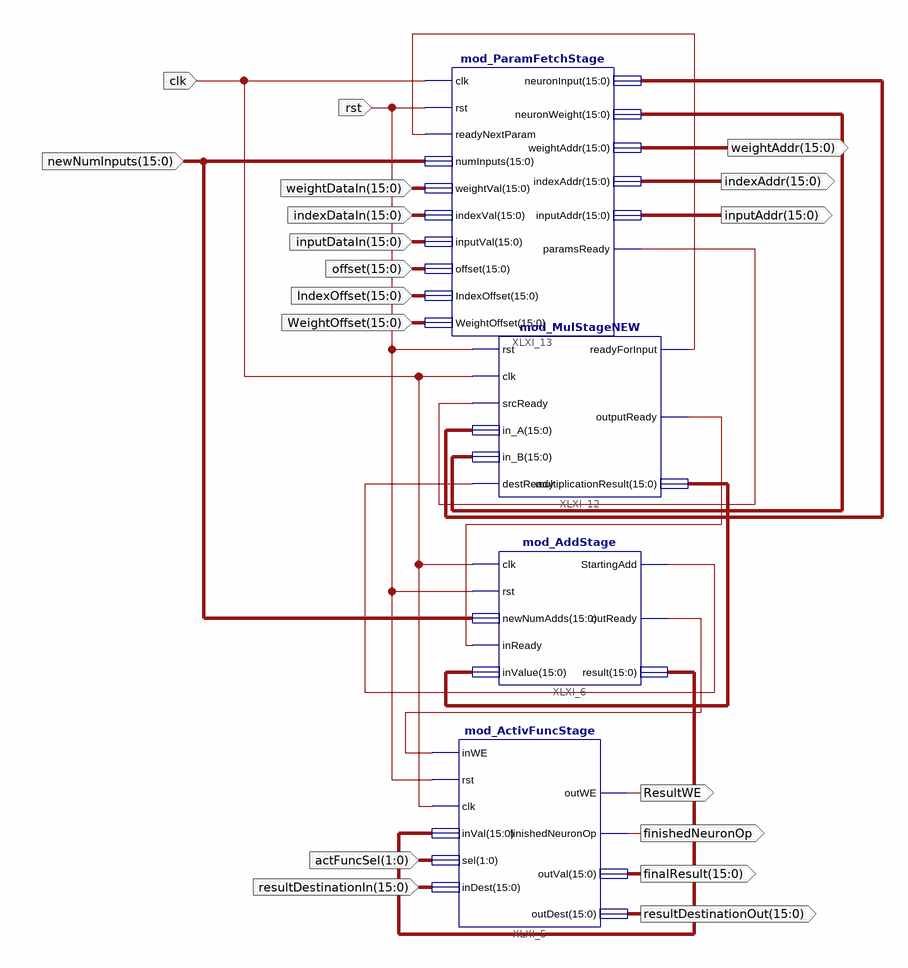
[diagram p0: schematic sheet 1]
// Xilinx ISE schematic mod_OpUnitNEW.sch (spartan3e) as structural Verilog: 4 symbols, 18 ports
module mod_OpUnitNEW (
  input  rst,
  input  [1:0] actFuncSel,
  input  [15:0] resultDestinationIn,
  input  [15:0] newNumInputs,
  input  [15:0] weightDataIn,
  input  [15:0] indexDataIn,
  input  [15:0] inputDataIn,
  input  [15:0] offset,
  input  clk,
  input  [15:0] IndexOffset,
  input  [15:0] WeightOffset,
  output [15:0] resultDestinationOut,
  output [15:0] finalResult,
  output ResultWE,
  output finishedNeuronOp,
  output [15:0] indexAddr,
  output [15:0] inputAddr,
  output [15:0] weightAddr
);

  wire XLXN_4, XLXN_8, XLXN_15, XLXN_16, XLXN_28;
  wire [15:0] XLXN_10, XLXN_11, XLXN_12, XLXN_20;

  mod_ActivFuncStage XLXI_5 (
    .inWE(XLXN_16), .rst(rst), .clk(clk), .inVal(XLXN_12), .sel(actFuncSel), .inDest(resultDestinationIn),
    .outWE(ResultWE), .finishedNeuronOp(finishedNeuronOp), .outVal(finalResult),
    .outDest(resultDestinationOut));
  mod_AddStage XLXI_6 (
    .clk(clk), .rst(rst), .newNumAdds(newNumInputs), .inReady(XLXN_28), .inValue(XLXN_20),
    .StartingAdd(XLXN_15), .outReady(XLXN_16), .result(XLXN_12));
  mod_MulStageNEW XLXI_12 (
    .rst(rst), .clk(clk), .srcReady(XLXN_4), .in_A(XLXN_10), .in_B(XLXN_11), .destReady(XLXN_15),
    .readyForInput(XLXN_8), .outputReady(XLXN_28), .multiplicationResult(XLXN_20));
  mod_ParamFetchStage XLXI_13 (
    .clk(clk), .rst(rst), .readyNextParam(XLXN_8), .numInputs(newNumInputs), .weightVal(weightDataIn),
    .indexVal(indexDataIn), .inputVal(inputDataIn), .offset(offset), .neuronInput(XLXN_10),
    .neuronWeight(XLXN_11), .weightAddr(weightAddr), .indexAddr(indexAddr), .inputAddr(inputAddr),
    .paramsReady(XLXN_4), .IndexOffset(IndexOffset), .WeightOffset(WeightOffset));
endmodule
